# Altium schematic sheet Connector.SchDoc
size A4
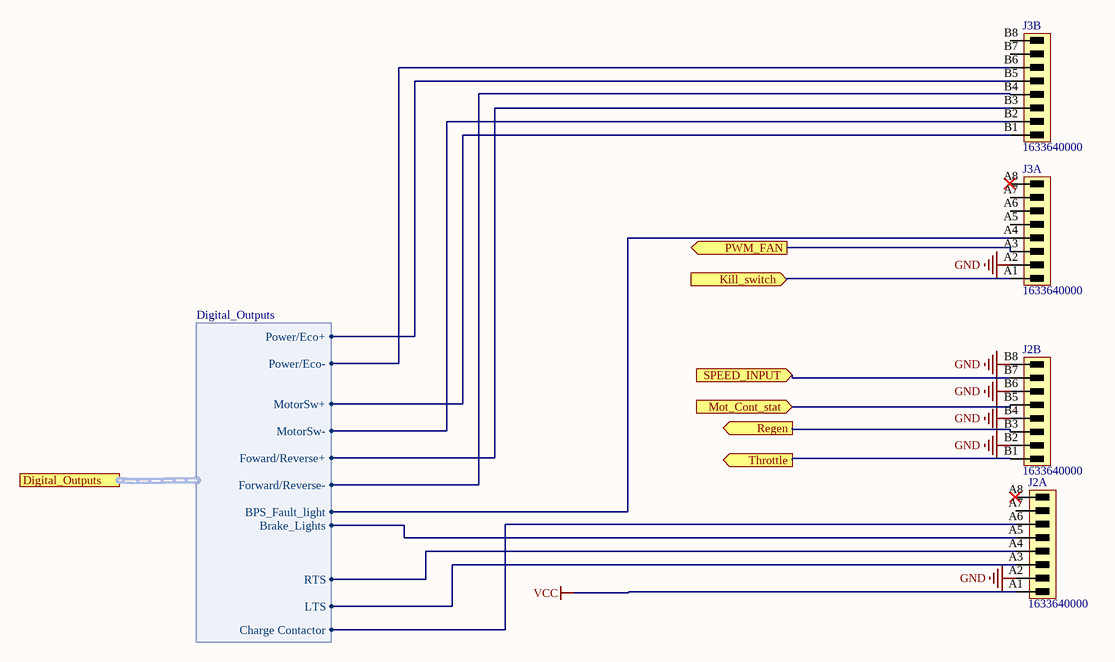
[diagram p0: Connector.SchDoc]

## Parts
J2  1633640000  [SLD_3_50_90G_16]  (parts A,B of 2)
J3  1633640000  [SLD_3_50_90G_16]  (parts A,B of 2)

## Ports
Digital_Outputs (harness Digital_Outputs), Kill_switch (in), Mot_Cont_stat (in), PWM_FAN (out), Regen (out), SPEED_INPUT (in), Throttle (out)

## Harnesses
Digital_Outputs: LTS, RTS, Power/Eco+, Power/Eco-, MotorSw+, MotorSw-, Foward/Reverse+, Forward/Reverse-, Brake_Lights, BPS_Fault_light, Charge Contactor

## Nets
GND: J2.A2 J2.B2 J2.B4 J2.B6 J2.B8 J3.A2
VCC: J2.A1
Kill_switch: J3.A1 ; port Kill_switch
Mot_Cont_stat: J2.B5 ; port Mot_Cont_stat
PWM_FAN: J3.A3 ; port PWM_FAN
Regen: J2.B3 ; port Regen
SPEED_INPUT: J2.B7 ; port SPEED_INPUT
Throttle: J2.B1 ; port Throttle
NetJ2_A3: J2.A3 ; port Digital_Outputs.LTS
NetJ2_A4: J2.A4 ; port Digital_Outputs.RTS
NetJ2_A5: J2.A5 ; port Digital_Outputs.Brake_Lights
NetJ2_A6: J2.A6 ; port Digital_Outputs.Charge Contactor
NetJ3_A4: J3.A4 ; port Digital_Outputs.BPS_Fault_light
NetJ3_B1: J3.B1 ; port Digital_Outputs.MotorSw+
NetJ3_B2: J3.B2 ; port Digital_Outputs.MotorSw-
NetJ3_B3: J3.B3 ; port Digital_Outputs.Foward/Reverse+
NetJ3_B4: J3.B4 ; port Digital_Outputs.Forward/Reverse-
NetJ3_B5: J3.B5 ; port Digital_Outputs.Power/Eco+
NetJ3_B6: J3.B6 ; port Digital_Outputs.Power/Eco-

Not connected (* = marked no-connect by the designer): J2 A7 A8*; J3 A5 A6 A7 A8* B7 B8

## Library data of the parts
J2 J3 = CMP-1559-01473-1: OMNIMATE Signal - series BL/SL 3.50; Manufacturer: Weidmueller; Outgoing_elbow: 90°; Side_termination_characteristic: closed side; No_of_poles: 16; Mounting_onto_the_PCB: Solder connection; Contact_surface: tinned; Rated_voltage_for_surge_voltage_class_pollution_degree_II_2: 200 V; Rated_current_min_no_of_poles_TU_20_deg_C: 32 A; Insulating_material: PBT; Contact_material: CuSn; UL_94_flammability_rating: V-0; Pitch_inch: 0.138 inch; Short_text_for_material: SLD 3.50/16/90G 3.2SN OR BX; Pitch_mm: 3.5 mm; Rated_voltage_use_group_B_UL_1059: 300 V; Rated_current_use_group_B_UL_1059: 8 A; Solder_pin_length_mm: 3.2 mm; ComponentLink2URL: http://catalog.weidmueller.com/catalog/Start.do?localeId=en&ObjectID=1633640000; Colour: Orange; Revision: V1; PackageReference: SLD_3_50_90G_16; Packaging: Box; ComponentLink1Description: Manufacturer URL; ComponentLink2Description: URL Link1; ComponentLink1URL: http://www.weidmueller.com/; PartNumber: 1633640000; Qty: 20 PCS